# EAGLE design SkaarhojFaderboard (EAGLE 7.5.0)
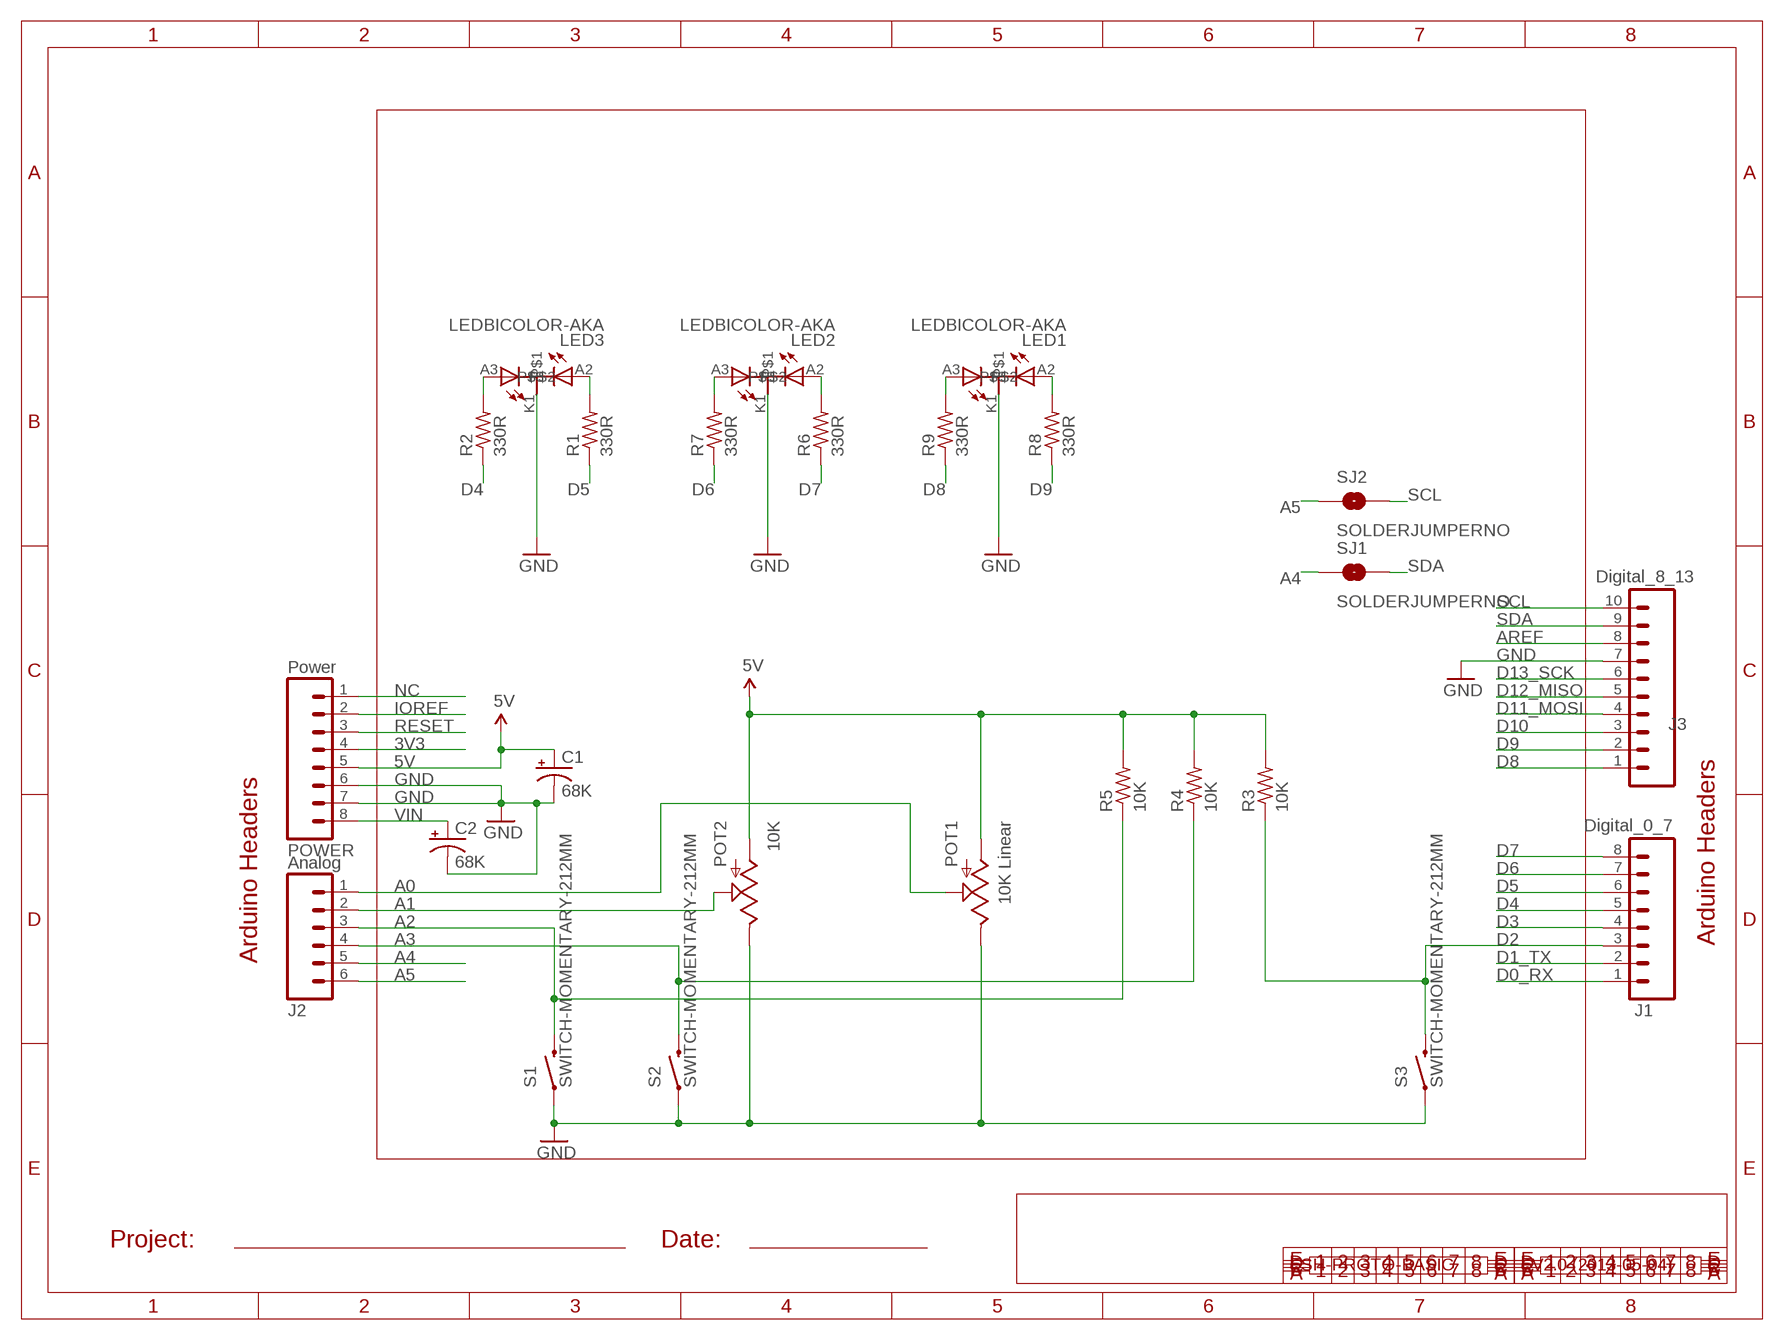
[diagram p0: schematic, sheet 1]

## Parts
C1  68K  CAP_POLPTH1  [CPOL-RADIAL-100UF-25V]
C2  68K  CAP_POLPTH1  [CPOL-RADIAL-100UF-25V]
J1  Digital_0_7  M08  [1X08]
J2  Analog  M06SIP  [1X06]
J3  Digital_8_13  M100.1  [1X10]
LED1  LEDBICOLOR-AKA  [LED5MM-BICOLOR]
LED2  LEDBICOLOR-AKA  [LED5MM-BICOLOR]
LED3  LEDBICOLOR-AKA  [LED5MM-BICOLOR]
POT1  10K Linear  SLIDER20  [SLIDER20]
POT2  10K  POT  [ALPS_POT]
POWER  Power  M08  [1X08]
R1  330R  R-US_0207/10  [0207/10]
R2  330R  R-US_0207/10  [0207/10]
R3  10K  R-US_0207/10  [0207/10]
R4  10K  R-US_0207/10  [0207/10]
R5  10K  R-US_0207/10  [0207/10]
R6  330R  R-US_0207/10  [0207/10]
R7  330R  R-US_0207/10  [0207/10]
R8  330R  R-US_0207/10  [0207/10]
R9  330R  R-US_0207/10  [0207/10]
S1  SWITCH-MOMENTARY-212MM  [TACTILE-PTH-12MM]
S2  SWITCH-MOMENTARY-212MM  [TACTILE-PTH-12MM]
S3  SWITCH-MOMENTARY-212MM  [TACTILE-PTH-12MM]
SJ1  SOLDERJUMPERNO  [SJ_2S-NO]
SJ2  SOLDERJUMPERNO  [SJ_2S-NO]

## Nets
3V3: POWER.4
5V [Power]: C1.1(+) POT1.3(A) POT2.P$3(A) POWER.5 R3.2 R4.2 R5.2
A0: J2.1 POT1.2A(S)
A1: J2.2 POT2.P$2(S)
A2: J2.3 R5.1 S1.3
A3: J2.4 R4.1 S2.3
A4: J2.5 SJ1.1
A5: J2.6 SJ2.1
AREF: J3.8
D0_RX: J1.1
D1_TX: J1.2
D2: J1.3 R3.1 S3.3
D3: J1.4
D4: J1.5 R2.1
D5: J1.6 R1.1
D6: J1.7 R7.1
D7: J1.8 R6.1
D8: J3.1 R9.1
D9: J3.2 R8.1
D10: J3.3
D11_MOSI: J3.4
D12_MISO: J3.5
D13_SCK: J3.6
GND: C1.2(-) C2.2(-) J3.7 LED1.K1 LED2.K1 LED3.K1 POT1.1(E) POT2.P$1(E) POWER.6 POWER.7 S1.1 S2.1 S3.1
IOREF: POWER.2
N$1: LED2.A3 R7.2
N$2: LED3.A3 R2.2
N$3: LED2.A2 R6.2
N$4: LED3.A2 R1.2
N$5: LED1.A3 R9.2
N$6: LED1.A2 R8.2
NC: POWER.1
RESET: POWER.3
SCL: J3.10 SJ2.2
SDA: J3.9 SJ1.2
VIN: C2.1(+) POWER.8

## Notes on the sheet
- Arduino Headers
- Arduino Headers
- Project: | Date:
- SH-PROTO-BASIC | V2.0 (2013-05-04)

## Library data of the parts
C1 C2 = SparkFun:CAP_POL: Capacitor Polarized These are standard SMD and PTH capacitors. Normally 10uF, 47uF, and 100uF in electrolytic and tantalum varieties. Always verify the external diameter of the through hole cap, it varies with capacity, voltage, and manufacturer. The EIA devices should be standard.
J1 = freetronics:M08: Header 8 Standard 8-pin 0.1" header. Use with straight break away headers (SKU : PRT-00116), right angle break away headers (PRT-00553), swiss pins (PRT-00743), machine pins (PRT-00117), and female headers (PRT-00115).
J2 = freetronics:M06: Header 6 Standard 6-pin 0.1" header. Use with straight break away headers (SKU : PRT-00116), right angle break away headers (PRT-00553), swiss pins (PRT-00743), machine pins (PRT-00117), and female headers (PRT-00115). Molex polarized connector foot print use with SKU : PRT-08094 with associated crimp pins and housings. NOTES ON THE VARIANTS LOCK and LOCK_LONGPADS... This footprint was designed to help hold the alignment of a through-hole component (i.e. 6-pin header) while soldering it into place. You may notice that each hole has been shifted either up or down by 0.005 of an inch from it's more standard position (which is a perfectly straight line). This slight alteration caused the pins (the squares in the middle) to touch the edges of the holes. Because they are alternating, it causes a "brace" to hold the component in place. 0.005 has proven to be the perfect amount of "off-center" position when using our standard breakaway headers. Although looks a little odd when you look at the bare footprint, once you have a header in there, the alteration is very hard to notice. Also, if you push a header all the way into place, it is covered up entirely on the bottom side. This idea of altering the position of holes to aid alignment will be further integrated into the Sparkfun Library for other footprints. It can help hold any component with 3 or more connection pins.
J3 = freetronics-original:M10: Header 10 Standard 10-pin 0.1" header. Use with straight break away headers (SKU : PRT-00116), right angle break away headers (PRT-00553), swiss pins (PRT-00743), machine pins (PRT-00117), and female headers (PRT-00115).
LED1-LED3 = SKAARHOJ:LEDBICOLOR-AKA
POT1 = SKAARHOJ:SLIDER
POT2 = SparkFun:POT
POWER = freetronics-original:M08: Header 8 Standard 8-pin 0.1" header. Use with straight break away headers (SKU : PRT-00116), right angle break away headers (PRT-00553), swiss pins (PRT-00743), machine pins (PRT-00117), and female headers (PRT-00115).
R1-R9 = resistor:R-US_: RESISTOR, American symbol
S1-S3 = SparkFun:SWITCH-MOMENTARY-2
SJ1 SJ2 = SparkFun:SOLDERJUMPER: Solder Jumper Standard SMD solder jumper. Used to automate production. Two varients : Normally Open and Normally Closed are the same, but have different paste layers. NC will have a large amount of paste and should jumper during reflow.

## Net classes
0 default: width 0.305 mm, drill 0.61 mm, clearance 0.203 mm
1 Power: width 0.406 mm, drill 0.61 mm, clearance 0.203 mm

## Board
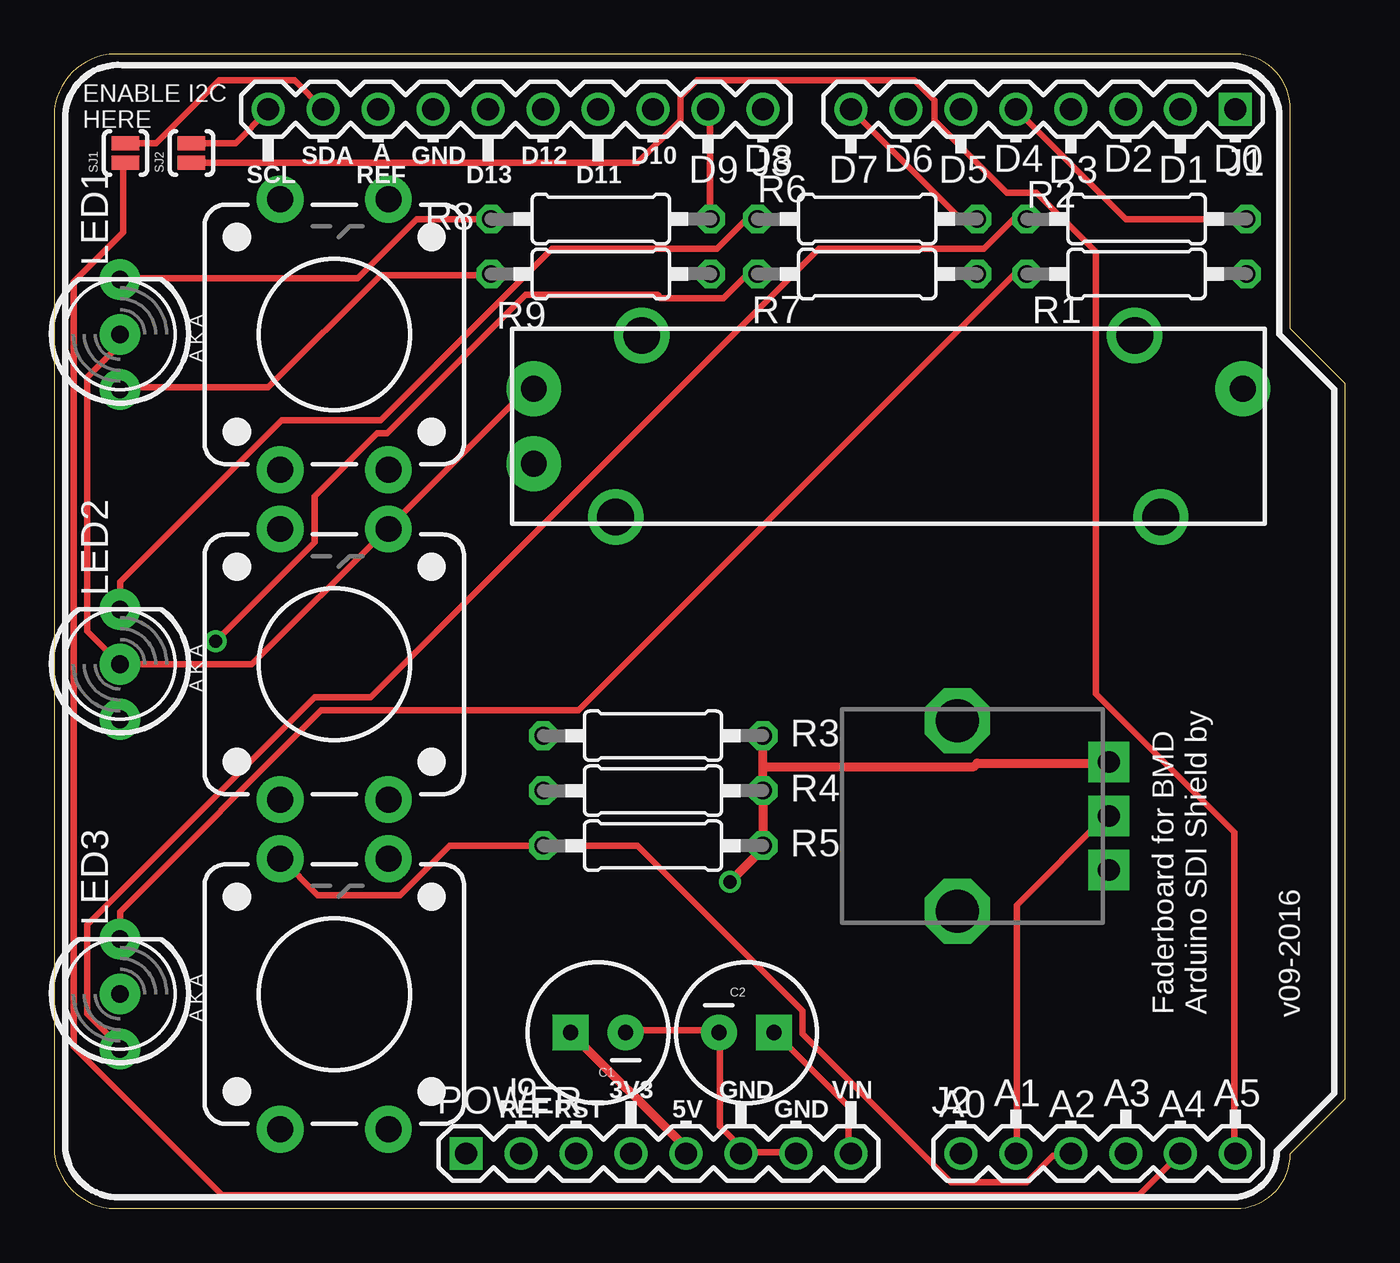
[diagram p1: board, top side]
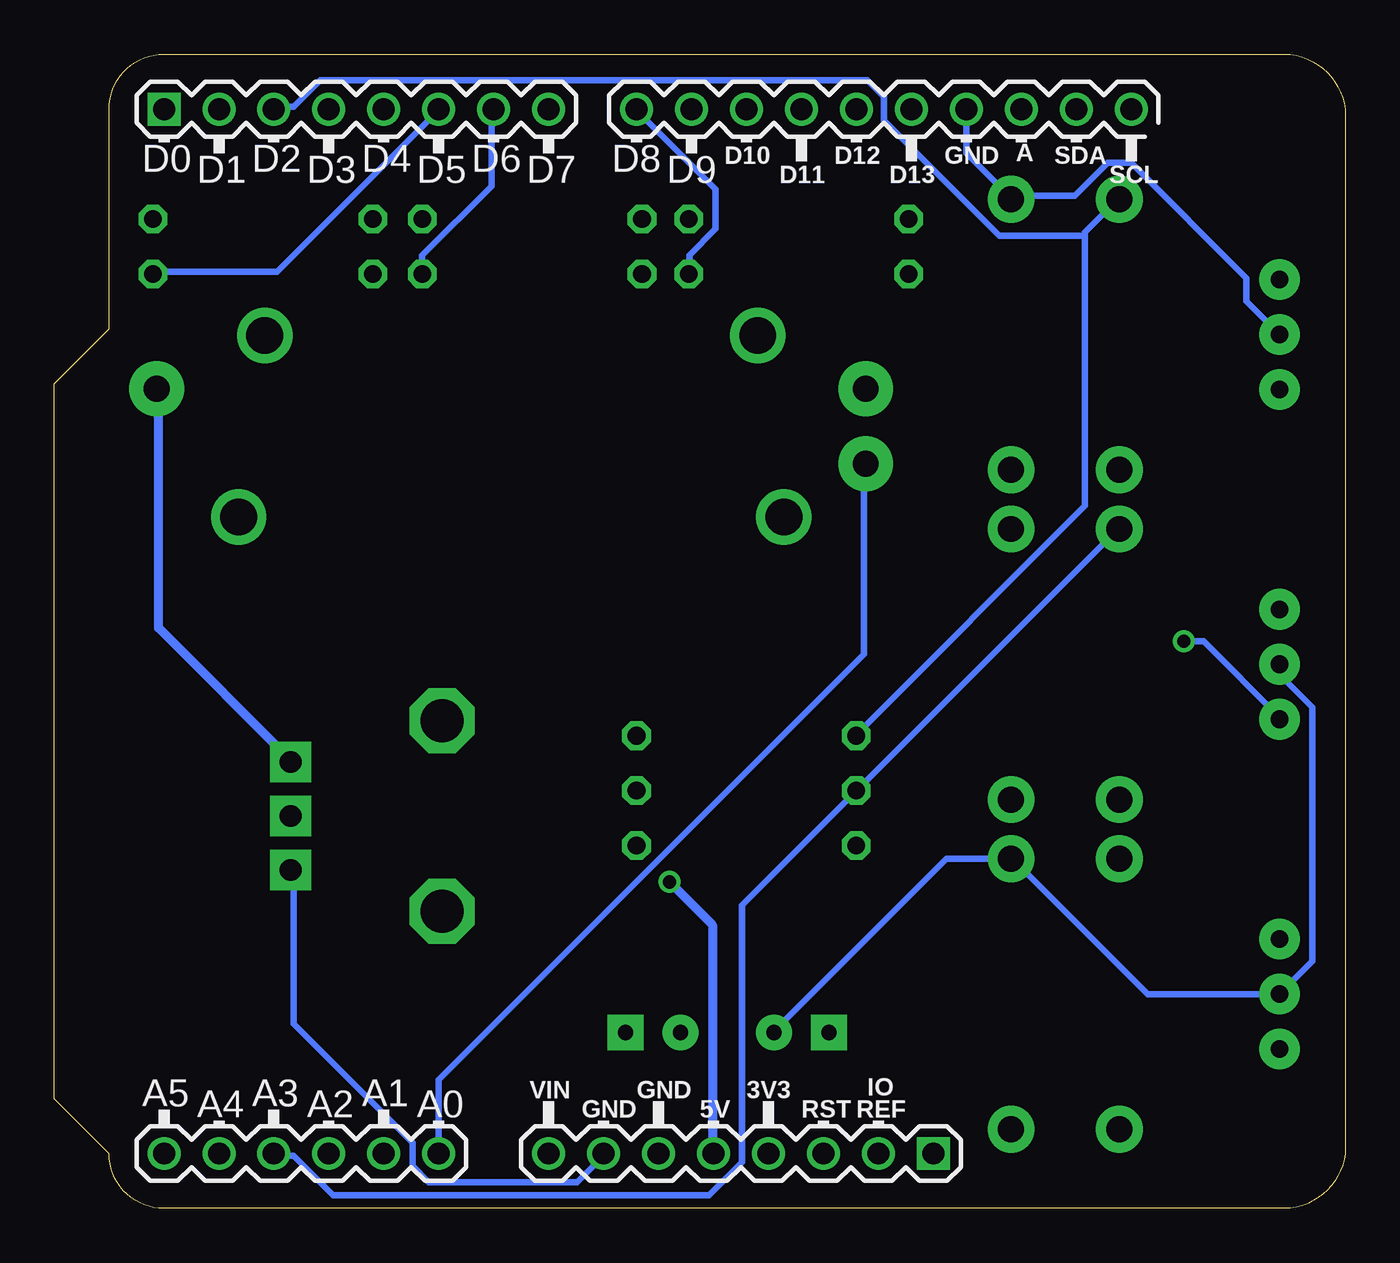
[diagram p2: board, bottom side, seen from below]

Size 59.69 x 53.34 mm. Coordinates in mm from the lower left corner, seen from the top.
Outline: 0,2.54 arc74 2.54,0 54.61,0 arc90 57.15,2.54 59.69,5.08 59.69,38.1 57.15,40.64 57.15,50.8 arc90 54.61,53.34 2.54,53.34 arc74 0,50.8 0,2.54
Copper layers (1*16): Top 0.035mm / dielectric 1.5mm / Bottom 0.035mm
Design rules "default *": minimum track width 10mil, minimum drill 24mil, track to track 12mil, track to pad 12mil, pad to pad 12mil, via to via 12mil, smd to smd 8mil, copper to edge 18mil, drill to drill 8mil, minimum pad ring 10mil, minimum via ring 8mil, stop-mask expansion 4mil, vias tented up to drill 0mil, thermal gap 10mil

### Footprints (pad centres in the part's own frame; a part is rotated, then mirrored left to right if it is on the bottom)
CPOL-RADIAL-100UF-25V = drill 0.7 pad 1.651 square: 1 1.27,0 | drill 0.7 pad 1.651: 2 -1.27,0
1X08 = drill 1.016 square: 1 0,0 | drill 1.016: 2 2.54,0; 3 5.08,0; 4 7.62,0; 5 10.16,0; 6 12.7,0; 7 15.24,0; 8 17.78,0
1X06 = drill 1.016: 1 0,0; 2 2.54,0; 3 5.08,0; 4 7.62,0; 5 10.16,0; 6 12.7,0
1X10 = drill 1.016: 1 0,0; 2 2.54,0; 3 5.08,0; 4 7.62,0; 5 10.16,0; 6 12.7,0; 7 15.24,0; 8 17.78,0; 9 20.32,0; 10 22.86,0
LED5MM-BICOLOR = drill 0.813 pad 1.88: A2 2.54,0; A3 -2.54,0; K1 0,0
SLIDER20 = drill 1.194 pad 2.54: 1 -16.383,1.74; 2A -16.383,-1.74; 3 16.383,1.74 | drill 1.702: P$1 -11.392,4.191; P$2 11.392,4.191; P$3 12.598,-4.191; P$4 -12.598,-4.191
ALPS_POT = drill 1 pad 1.88 square: P$1 7,-2.5; P$2 7,0; P$3 7,2.5 | drill 2 octagon: P$4 0,-4.4; P$5 0,4.4
0207/10 = drill 0.813 octagon: 1 -5.08,0; 2 5.08,0
TACTILE-PTH-12MM = drill 1.2 pad 2.159: 1 6.25,-2.5; 2 -6.25,-2.5; 3 6.25,2.5; 4 -6.25,2.5
SJ_2S-NO = smd 0.635 x 1.27: 1 -0.45,0; 2 0.45,0

### Placement (x,y rotation side)
C1  25.15,8.13 180 top
C2  32,8.13 0 top
J1  54.61,50.8 180 top
J2  41.91,2.54 0 top
J3  32.77,50.8 180 top
LED1  3.05,40.39 90 top
LED2  3.05,25.15 90 top
LED3  3.05,9.91 90 top
POT1  38.56,36.14 0 top
POT2  41.76,18.14 0 top
POWER  19.05,2.54 0 top
R1  50.04,43.18 180 top
R2  50.04,45.72 180 top
R3  27.69,21.84 0 top
R4  27.69,19.3 0 top
R5  27.69,16.76 0 top
R6  37.59,45.72 180 top
R7  37.59,43.18 180 top
R8  25.27,45.72 180 top
R9  25.27,43.18 180 top
S1  12.95,9.91 90 top
S2  12.95,25.15 90 top
S3  12.95,40.39 90 top
SJ1  3.3,48.77 90 top
SJ2  6.35,48.77 90 top

### Tracks (layer width: path | path; a pad name or v marks a point on that pad's centre or on a via)
5V  (via drill 0.61)
  Top 0.406: C1.1 29.11,2.9 29.11,2.59 POWER.5 | 32.77,20.42 R4.2 R5.2 32.77,16.61 v31.24,15.09 | 32.77,20.42 R3.2 | 32.77,20.42 42.52,20.42 42.67,20.57 48.62,20.57 POT2.P$3
  Bottom 0.406: POT1.3 54.86,37.8 54.86,26.82 48.77,20.73 POT2.P$3 | v31.24,15.09 29.26,13.11 29.26,2.59 POWER.5
A0
  Bottom 0.305: J2.1 41.91,5.94 22.25,25.6 22.25,34.29 POT1.2A
A1
  Top 0.305: J2.2 44.5,2.59 44.5,14.02 48.62,18.14 POT2.P$2
A2
  Top 0.305: S1.3 10.52,16.15 12.19,14.48 16,14.48 18.29,16.76 R5.1 26.98,16.76 34.59,9.14 34.59,8.08 41.45,1.22 44.96,1.22 46.18,2.44 46.94,2.44 J2.3
A3
  Bottom 0.305: S2.3 10.52,31.39 R4.1 27.89,14.02 27.89,2.13 29.41,0.61 46.79,0.61 48.62,2.44 49.53,2.44 J2.4
A4
  Top 0.305: J2.5 50.14,0.61 7.77,0.61 0.91,7.47 0.91,42.82 3.2,45.11 3.2,48.31 SJ1.1
A5
  Top 0.305: SJ2.1 6.4,48.31 26.98,48.31 28.96,50.29 28.96,51.36 29.72,52.12 39.78,52.12 40.69,51.21 40.69,50.29 44.04,46.94 45.41,46.94 48.16,44.2 48.16,23.77 54.56,17.37 54.56,2.59 J2.6
D2
  Bottom 0.305: 12.04,44.96 12.04,45.11 10.52,46.63 S3.3 | 12.04,44.96 12.04,32.46 22.55,21.95 R3.1 | 12.04,44.96 16,44.96 21.34,50.29 21.34,51.36 22.1,52.12 47.4,52.12 48.62,50.9 49.53,50.9 J1.3
D4
  Top 0.305: R2.1 49.53,45.72 J1.5
D5
  Bottom 0.305: R1.1 55.02,43.28 49.38,43.28 41.91,50.75 J1.6
D6
  Bottom 0.305: R7.1 42.67,44.04 39.47,47.24 39.47,50.75 J1.7
D7
  Top 0.305: R6.1 41.91,45.72 J1.8
D8
  Bottom 0.305: R9.1 30.33,43.28 30.33,44.04 29.11,45.26 29.11,47.09 32.77,50.75 J3.1
D9
  Top 0.305: R8.1 30.33,45.72 30.33,50.75 J3.2
GND
  Top 0.305: LED1.K1 3.05,39.93 1.52,38.41 1.52,26.67 LED2.K1 9.14,25.15 15.39,31.39 S2.1 15.54,31.55 21.79,37.8 22.1,37.8 POT1.1 | C1.2 26.52,8.23 30.63,8.23 C2.2 30.79,8.08 30.79,3.81 31.85,2.74 POWER.6 31.85,2.59 34.29,2.59 POWER.7
  Bottom 0.305: J3.7 17.53,48.77 15.54,46.79 S3.1 15.39,46.79 12.5,46.79 10.97,48.31 9.91,48.31 4.57,42.98 4.57,41.91 LED1.K1 | POT2.P$1 48.62,15.54 48.62,8.53 43.13,3.05 43.13,1.98 42.37,1.22 35.51,1.22 34.29,2.44 POWER.7 | C1.2 26.36,8.23 18.44,16.15 15.54,16.15 S1.1 15.39,16.15 9.14,9.91 LED3.K1 1.52,11.43 1.52,23.16 3.05,24.69 LED2.K1
N$1  (via drill 0.61)
  Top 0.305: v7.47,26.21 12.04,30.79 12.04,32.92 14.94,35.81 15.39,35.81 21.79,42.22 27.89,42.22 28.04,42.06 30.94,42.06 32,43.13 32.46,43.13 R7.2
  Bottom 0.305: v7.47,26.21 6.55,26.21 3.05,22.71 LED2.A3
N$2
  Top 0.305: R2.2 44.35,45.72 42.98,44.35 35.36,44.35 14.63,23.62 12.04,23.62 1.52,13.11 1.52,8.99 3.05,7.47 LED3.A3
N$3
  Top 0.305: R6.2 32,45.72 30.63,44.35 23.01,44.35 15.09,36.42 10.52,36.42 3.05,28.96 LED2.A2
N$4
  Top 0.305: LED3.A2 3.05,13.72 12.34,23.01 24.23,23.01 44.35,43.13 44.96,43.13 R1.2
N$5
  Top 0.305: R9.2 20.12,43.13 15.09,43.13 9.91,37.95 3.05,37.95 LED1.A3
N$6
  Top 0.305: R8.2 16.76,45.72 14.02,42.98 3.05,42.98 LED1.A2
SCL
  Top 0.305: SJ2.2 6.4,49.23 8.38,49.23 9.91,50.75 J3.10
SDA
  Top 0.305: J3.9 11.12,52.12 7.62,52.12 4.72,49.23 3.35,49.23 SJ1.2
VIN
  Top 0.305: POWER.8 36.73,2.59 36.73,4.72 33.38,8.08 C2.1

### Text on the board
tPlace: SDA | A | GND | D12 | D10 | D8 | D6 | D4 | D2 | D0 | SCL | REF | D13 | D11 | D9 | D7 | D5 | D3 | D1 | IO | 3V3 | GND | VIN | A1 | A3 | A5 | REF | RST | 5V | GND | A0 | A2 | A4
bPlace: SDA | A | GND | D12 | D10 | D8 | D6 | D4 | D2 | D0 | SCL | D13 | D11 | D9 | D7 | D5 | D3 | D1 | IO | 3V3 | GND | VIN | A1 | A3 | A5 | REF | RST | 5V | GND | A0 | A2 | A4
_tsilk: ENABLE I2C / HERE | Faderboard for BMD / Arduino SDI Shield by | v09-2016